# Altium schematic sheet STM32_miniSystem.SchDoc
size A4; SheetNumber: 1; SheetTotal: 7
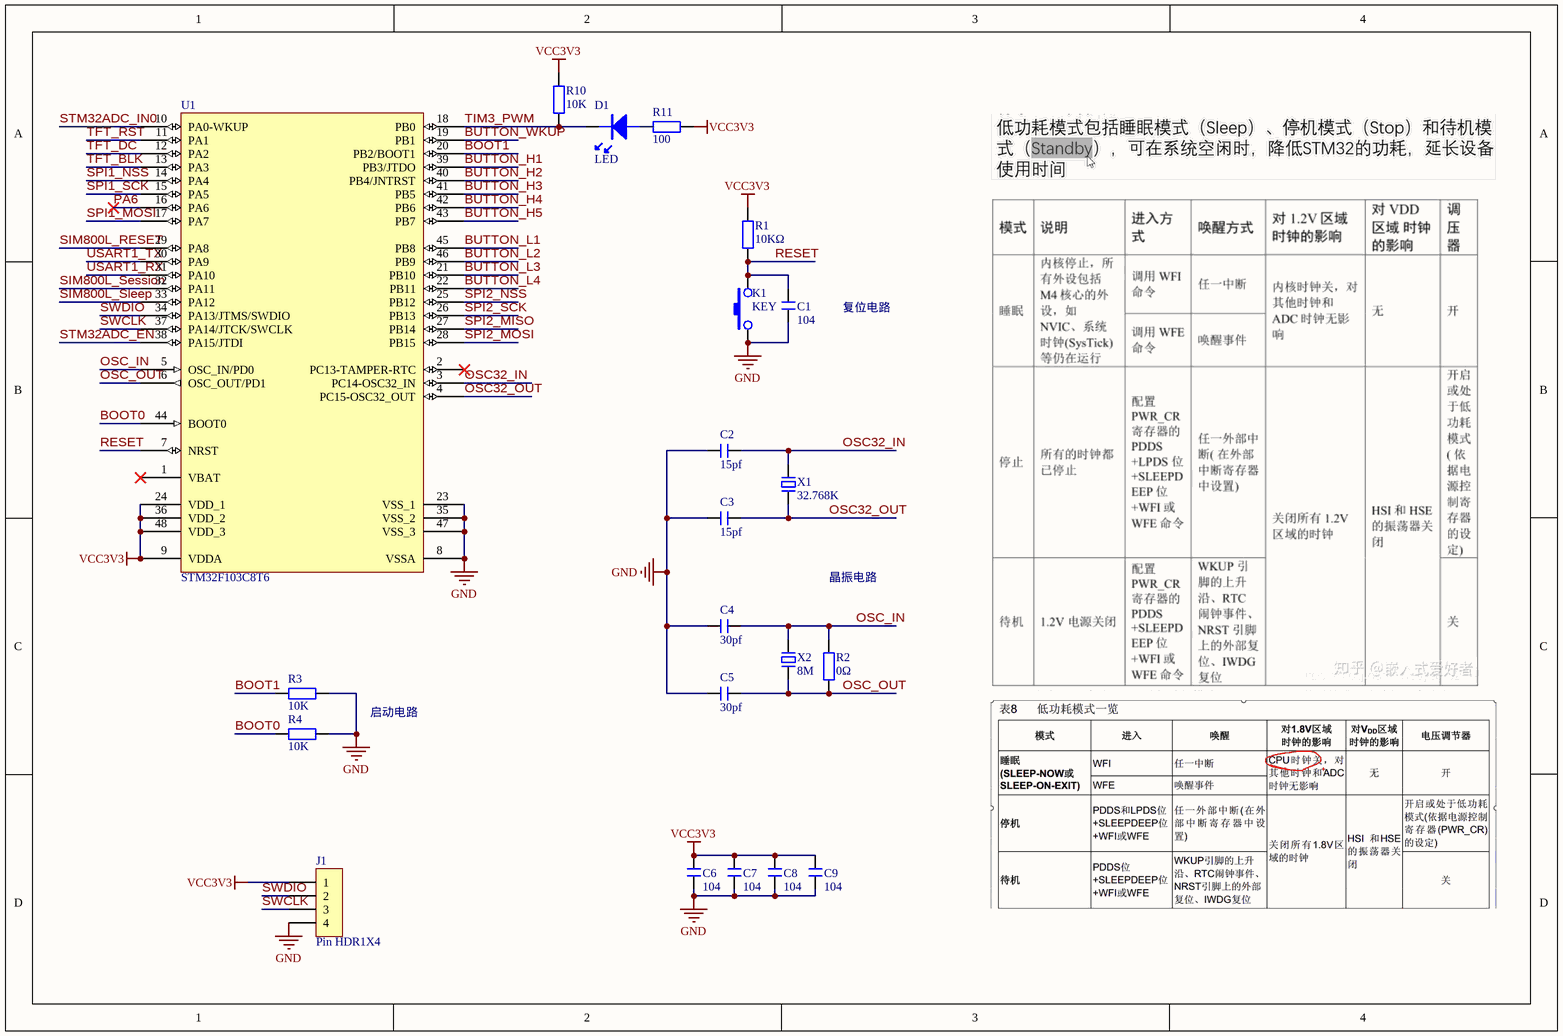
[diagram p0: STM32_miniSystem.SchDoc]

## Parts
C1  104  [C 0805_L]
C2  15pf  [CC 1.8*3.6]
C3  15pf  [CC 1.8*3.6]
C4  30pf  [CC 1.8*3.6]
C5  30pf  [CC 1.8*3.6]
C6  104  [C 0805_L]
C7  104  [C 0805_L]
C8  104  [C 0805_L]
C9  104  [C 0805_L]
D1  LED  [LED-0603G]
J1  Pin HDR1X4  [Pin HDR1X4/2.54mm-W]
K1  KEY  [DIP-12X12X6]
R1  10KΩ  [R 0805_L]
R2  0Ω  [R 0805_L]
R3  10K  [R 0805_L]
R4  10K  [R 0805_L]
R10  10K  [R 0805_L]
R11  100  [R 0805_L]
U1  STM32F103C8T6  [LQFP48 7X7]
X1  32.768K  [OSC-3x10-WI-B]
X2  8M  [OSC HC-49S]

## Nets
GND: C1.1 C2.1 C3.1 C4.1 C5.1 C6.1 C7.1 C8.1 C9.1 J1.4 K1.1 R3.2 R4.1 U1.8(VSSA) U1.23(VSS_1) U1.35(VSS_2) U1.47(VSS_3)
VCC3V3: C6.2 C7.2 C8.2 C9.2 J1.1 R1.2 R10.2 R11.2 U1.9(VDDA) U1.24(VDD_1) U1.36(VDD_2) U1.48(VDD_3)
BOOT0: R4.2 U1.44(BOOT0)
BOOT1: R3.1 U1.20(PB2/BOOT1)
BUTTON_H1: U1.39(PB3/JTDO)
BUTTON_H2: U1.40(PB4/JNTRST)
BUTTON_H3: U1.41(PB5)
BUTTON_H4: U1.42(PB6)
BUTTON_H5: U1.43(PB7)
BUTTON_L1: U1.45(PB8)
BUTTON_L2: U1.46(PB9)
BUTTON_L3: U1.21(PB10)
BUTTON_L4: U1.22(PB11)
BUTTON_WKUP: U1.19(PB1)
OSC32_IN: C2.2 U1.3(PC14-OSC32_IN) X1.2
OSC32_OUT: C3.2 U1.4(PC15-OSC32_OUT) X1.1
OSC_IN: C4.2 R2.2 U1.5(OSC_IN/PD0) X2.2
OSC_OUT: C5.2 R2.1 U1.6(OSC_OUT/PD1) X2.1
PA6: U1.16(PA6)
RESET: C1.2 K1.3 R1.1 U1.7(NRST)
SIM800L_RESET: U1.29(PA8)
SIM800L_Session: U1.32(PA11)
SIM800L_Sleep: U1.33(PA12)
SPI1_MOSI: U1.17(PA7)
SPI1_NSS: U1.14(PA4)
SPI1_SCK: U1.15(PA5)
SPI2_MISO: U1.27(PB14)
SPI2_MOSI: U1.28(PB15)
SPI2_NSS: U1.25(PB12)
SPI2_SCK: U1.26(PB13)
STM32ADC_EN: U1.38(PA15/JTDI)
STM32ADC_IN0: U1.10(PA0-WKUP)
SWCLK: J1.3 U1.37(PA14/JTCK/SWCLK)
SWDIO: J1.2 U1.34(PA13/JTMS/SWDIO)
TFT_BLK: U1.13(PA3)
TFT_DC: U1.12(PA2)
TFT_RST: U1.11(PA1)
TIM3_PWM: D1.K R10.1 U1.18(PB0)
USART1_RX: U1.31(PA10)
USART1_TX: U1.30(PA9)
NetD1_A: D1.A R11.1

Not connected (* = marked no-connect by the designer): U1 1(VBAT)* 2(PC13-TAMPER-RTC)*

## Notes on the sheet
- 复位电路
- 晶振电路
- 启动电路

## Library data of the parts
C1 C6-C9 = C: 无极性贴片电容; 版权归属: 源创客; 材质: X7R; BOM名称: 无极性贴片电容; 学习资源: www.ooocke.com
C2 C3 = C-CC_1: 直插瓷片电容; 版权归属: 源创客; BOM名称: 直插瓷片电容; 学习资源: www.ooocke.com
C4 C5 = C-CC_2: 直插瓷片电容; 版权归属: 源创客; BOM名称: 直插瓷片电容; 学习资源: www.ooocke.com
R1 R2 = R: 贴片电阻; 版权归属: 源创客; BOM名称: 贴片电阻; 学习资源: www.ooocke.com
R3 R4 R10 = R_3: 贴片电阻; 版权归属: 源创客; BOM名称: 贴片电阻; 学习资源: www.ooocke.com
R11 = R_2: 贴片电阻; 版权归属: 源创客; BOM名称: 贴片电阻; 学习资源: www.ooocke.com
X1 = XTAL-2P: 32.768K_2脚无源脚晶振
X2 = XTAL-2P_1: 8M_2脚无源脚晶振